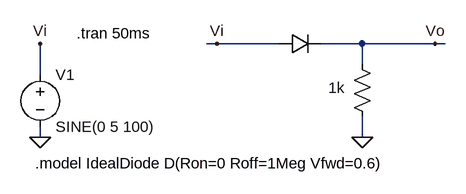
[diagram p0: schematic D-R.asc]
D-R.asc, the LTspice schematic file:
Version 4
SHEET 1 880 680
WIRE 0 128 -16 128
WIRE 96 128 0 128
WIRE 224 128 160 128
WIRE 336 128 224 128
WIRE 352 128 336 128
WIRE 224 160 224 128
WIRE -272 176 -272 128
WIRE -272 272 -272 256
WIRE 224 272 224 240
FLAG 224 272 0
FLAG 0 128 Vi
FLAG 336 128 Vo
FLAG -272 272 0
FLAG -272 128 Vi
SYMBOL voltage -272 160 R0
WINDOW 123 0 0 Left 0
WINDOW 39 0 0 Left 0
SYMATTR InstName V1
SYMATTR Value SINE(0 5 100)
SYMBOL res 240 256 R180
WINDOW 0 36 76 Invisible 2
WINDOW 3 43 60 Left 2
SYMATTR InstName R1
SYMATTR Value 1k
SYMBOL diode 96 144 R270
WINDOW 0 32 32 Invisible 2
WINDOW 3 0 32 Invisible 2
SYMATTR InstName D1
SYMATTR Value IdealDiode
TEXT -216 112 Left 2 !.tran 50ms
TEXT -280 312 Left 2 !.model IdealDiode D(Ron=0 Roff=1Meg Vfwd=0.6)

The netlist it stands for:
* D-R.asc
V1 Vi 0 SINE(0 5 100)
R1 0 Vo 1k
D1 Vi Vo IdealDiode
.model D D
.lib standard.dio
.tran 50ms
.model IdealDiode D(Ron=0 Roff=1Meg Vfwd=0.6)
.backanno
.end